# Altium project PCB.PrjPCB
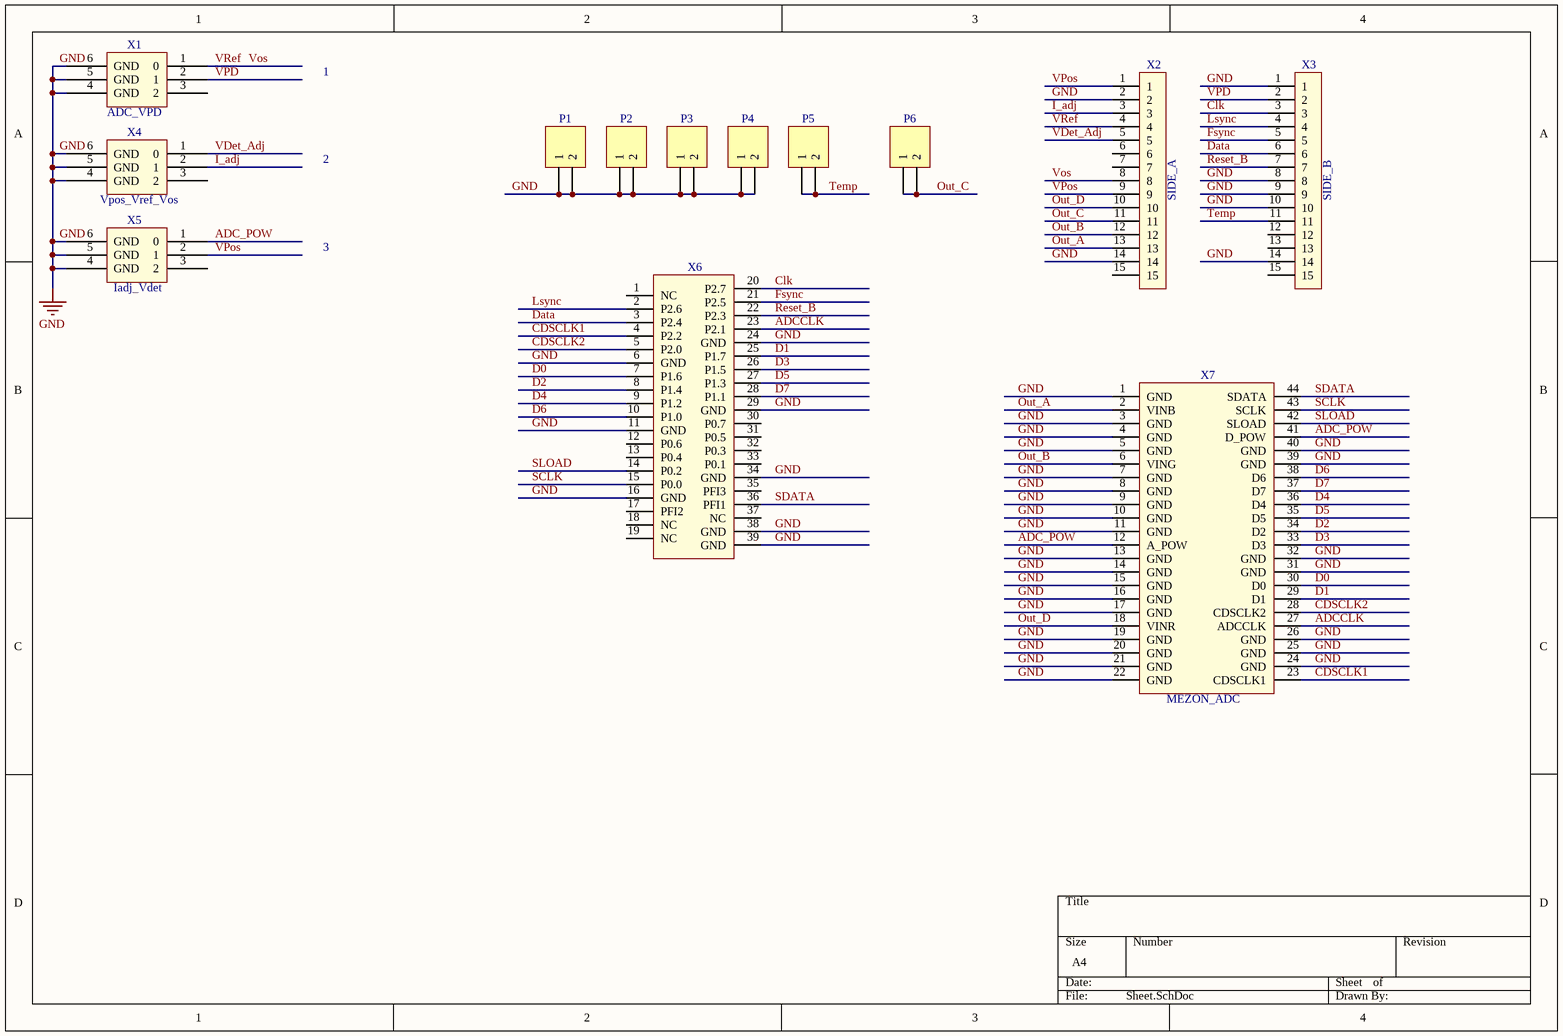
[diagram p0: Sheet.SchDoc]
1 sheet, 13 parts. Net scope: global (net labels, ports and power ports of the same name join across sheets).
Board file: IFP.PcbDoc

## Sheet Sheet.SchDoc
size A4

### Parts
P1  Header 2  [HDR1X2]  (value not drawn)
P2  Header 2  [HDR1X2]  (value not drawn)
P3  Header 2  [HDR1X2]  (value not drawn)
P4  Header 2  [HDR1X2]  (value not drawn)
P5  Header 2  [HDR1X2]  (value not drawn)
P6  Header 2  [HDR1X2]  (value not drawn)
X1  ADC_VPD  [POWER]
X2  SIDE_A  [INCAM_CONNECTOR_FPGA_15_QUADRO]
X3  SIDE_B  [INCAM_CONNECTOR_FPGA_15_QUADRO]
X4  Vpos_Vref_Vos  [POWER]
X5  Iadj_Vdet  [POWER]
X6  CHEAP_CON_37_FEMALE  [CHEAP_CONN_FEMALE]  (value not drawn)
X7  MEZON_ADC  [MEZON_ADC]

### Nets
GND: P1.1 P1.2 P2.1 P2.2 P3.1 P3.2 P4.1 P4.2 X1.4(GND) X1.5(GND) X1.6(GND) X2.2 X2.14 X3.1 X3.8 X3.9 X3.10 X3.14 X4.4(GND) X4.5(GND) X4.6(GND) X5.4(GND) X5.5(GND) X5.6(GND) X6.6(GND) X6.11(GND) X6.16(GND) X6.24(GND) X6.29(GND) X6.34(GND) X6.38(GND) X6.39(GND) X7.1(GND) X7.3(GND) X7.4(GND) X7.5(GND) X7.7(GND) X7.8(GND) X7.9(GND) X7.10(GND) X7.11(GND) X7.13(GND) X7.14(GND) X7.15(GND) X7.16(GND) X7.17(GND) X7.19(GND) X7.20(GND) X7.21(GND) X7.22(GND) X7.24(GND) X7.25(GND) X7.26(GND) X7.31(GND) X7.32(GND) X7.39(GND) X7.40(GND)
ADC_POW: X5.1(0) X7.12(A_POW) X7.41(D_POW)
ADCCLK: X6.23(P2.1) X7.27(ADCCLK)
CDSCLK1: X6.4(P2.2) X7.23(CDSCLK1)
CDSCLK2: X6.5(P2.0) X7.28(CDSCLK2)
Clk: X3.3 X6.20(P2.7)
D0: X6.7(P1.6) X7.30(D0)
D1: X6.25(P1.7) X7.29(D1)
D2: X6.8(P1.4) X7.34(D2)
D3: X6.26(P1.5) X7.33(D3)
D4: X6.9(P1.2) X7.36(D4)
D5: X6.27(P1.3) X7.35(D5)
D6: X6.10(P1.0) X7.38(D6)
D7: X6.28(P1.1) X7.37(D7)
Data: X3.6 X6.3(P2.4)
Fsync: X3.5 X6.21(P2.5)
I_adj: X2.3 X4.2(1)
Lsync: X3.4 X6.2(P2.6)
Out_A: X2.13 X7.2(VINB)
Out_B: X2.12 X7.6(VING)
Out_C: P6.1 P6.2 X2.11
Out_D: X2.10 X7.18(VINR)
Reset_B: X3.7 X6.22(P2.3)
SCLK: X6.15(P0.0) X7.43(SCLK)
SDATA: X6.36(PFI1) X7.44(SDATA)
SLOAD: X6.14(P0.2) X7.42(SLOAD)
Temp: P5.1 P5.2 X3.11
VDet_Adj: X2.5 X4.1(0)
Vos: X1.1(0) X2.4 X2.8  [also labelled VRef]
VPD: X1.2(1) X3.2
VPos: X2.1 X2.9 X5.2(1)

Not connected (* = marked no-connect by the designer): X1 3(2); X2 6 7 15; X3 12 13 15; X4 3(2); X5 3(2); X6 1(NC) 12(P0.6) 13(P0.4) 17(PFI2) 18(NC) 19(NC) 30(P0.7) 31(P0.5) 32(P0.3) 33(P0.1) 35(PFI3) 37(NC)

### Notes on the sheet
- 1
- 2
- 3

### Library data of the parts
P1-P6 = Header 2: Header, 2-Pin; LatestRevisionDate: 17-Jul-2002; LatestRevisionNote: Re-released for DXP Platform.; Publisher: Altium Limited
X1 X4 X5 = POWER
X2 X3 = INCAM_15_QUADRO